# Altium project St_Olavs_Alarm.PrjPcb
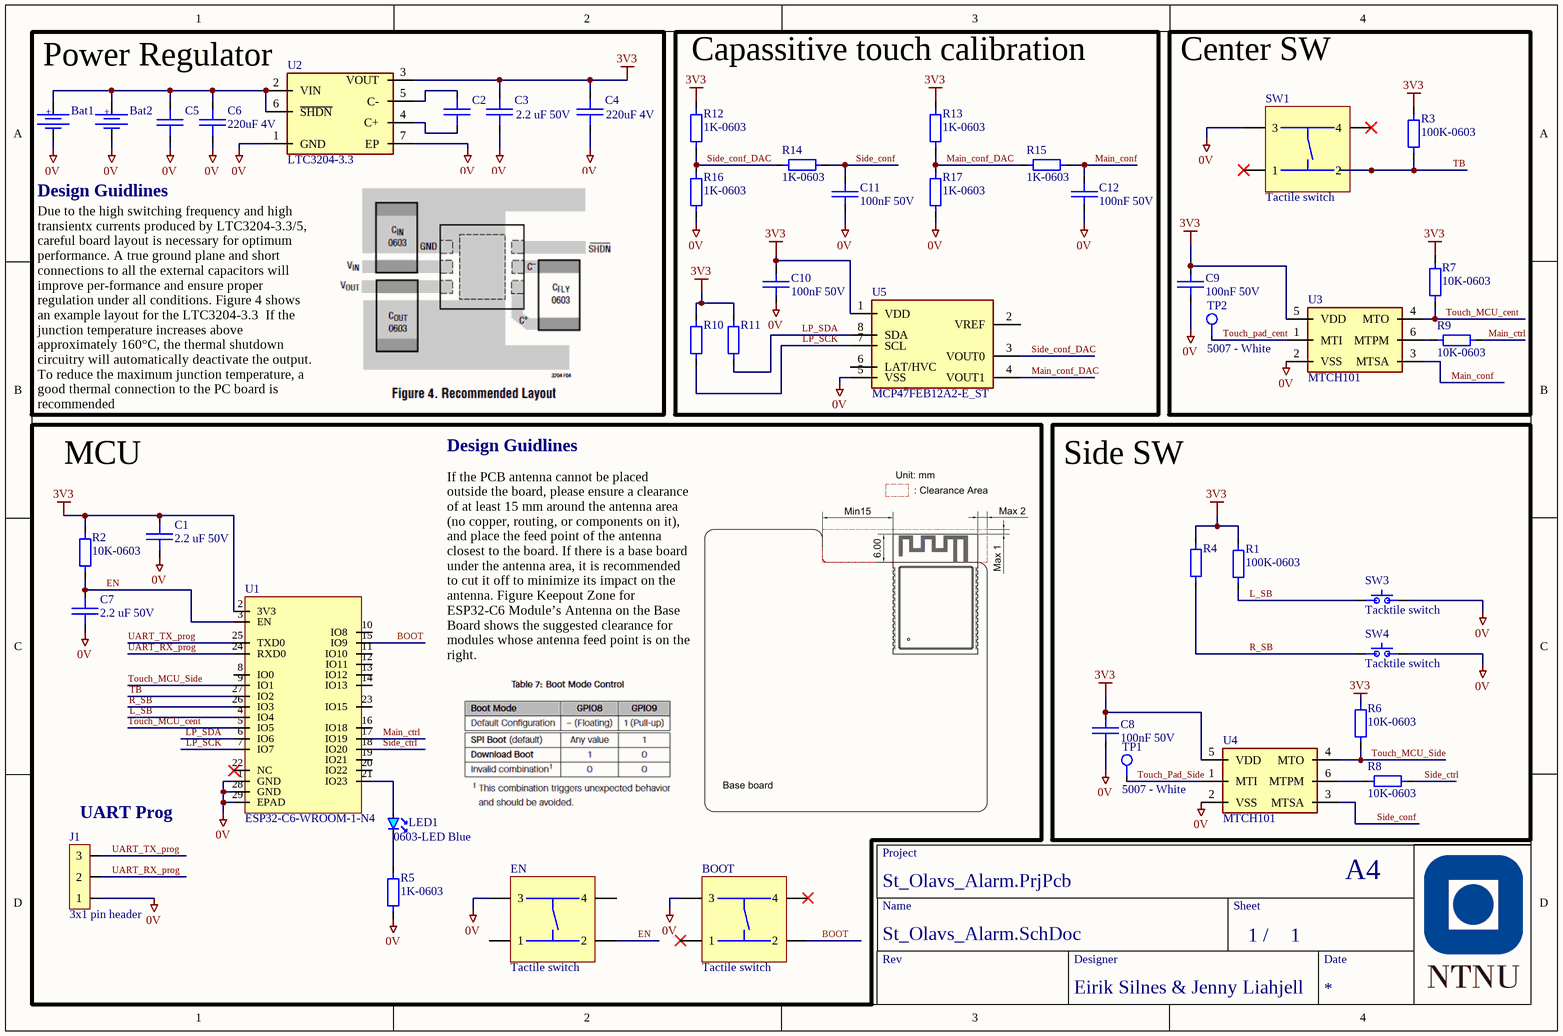
[diagram p0: St_Olavs_Alarm.SchDoc]
ProjectEngineer: Eirik Silnes & Jenny Liahjell
1 sheet, 45 parts. Net scope: strictly hierarchical (ports join the sheet entries above them; power ports are local).
Board file: St_Olavs_Alarm.PcbDoc

## Sheet St_Olavs_Alarm.SchDoc
size 292 x 193 mm; SheetNumber: 1; SheetTotal: 1

### Parts
Bat1  Bat Holder L-KLS5-CR2032-23-B1  [L-KLS5-CR2032-23-B1]  (value not drawn)
Bat2  Bat Holder L-KLS5-CR2032-23-B1  [L-KLS5-CR2032-23-B1]  (value not drawn)
BOOT  Tactile switch  [TE connectivity part no. 2-1437565-8]
C1  2.2 uF 50V  [0603 Capacitor]
C2  2.2 uF 50V  [0603 Capacitor]  (value not drawn)
C3  2.2 uF 50V  [0603 Capacitor]
C4  220uF 4V  [1206 CAPC3216X190N]
C5  220uF 4V  [1206 CAPC3216X190N]  (value not drawn)
C6  220uF 4V  [1206 CAPC3216X190N]
C7  2.2 uF 50V  [0603 Capacitor]
C8  100nF 50V  [0603 Capacitor]
C9  100nF 50V  [0603 Capacitor]
C10  100nF 50V  [0603 Capacitor]
C11  100nF 50V  [0603 Capacitor]
C12  100nF 50V  [0603 Capacitor]
EN  Tactile switch  [TE connectivity part no. 2-1437565-8]
J1  3x1 pin header  [Pin Header 1x3 TH Pitch 2.54mm]
LED1  0603-LED Blue  [0603-Diode LED, Blue]
R1  100K-0603  [0603 RESISTOR]
R2  10K-0603  [0603 RESISTOR]
R3  100K-0603  [0603 RESISTOR]
R4  100K-0603  [0603 RESISTOR]  (value not drawn)
R5  1K-0603  [0603 RESISTOR]
R6  10K-0603  [0603 RESISTOR]
R7  10K-0603  [0603 RESISTOR]
R8  10K-0603  [0603 RESISTOR]
R9  10K-0603  [0603 RESISTOR]
R10  10K-0603  [0603 RESISTOR]  (value not drawn)
R11  10K-0603  [0603 RESISTOR]  (value not drawn)
R12  1K-0603  [0603 RESISTOR]
R13  1K-0603  [0603 RESISTOR]
R14  1K-0603  [0603 RESISTOR]
R15  1K-0603  [0603 RESISTOR]
R16  1K-0603  [0603 RESISTOR]
R17  1K-0603  [0603 RESISTOR]
SW1  Tactile switch  [430182080816]
SW3  Tacktile switch  [KSS241GLFS]
SW4  Tacktile switch  [KSS241GLFS]
TP1  5007 - White  [5006-Footprint-1]
TP2  5007 - White  [5006-Footprint-1]
U1  ESP32-C6-WROOM-1-N4  [ESP32-C6-WROOM-1-N4-Footprint-1]
U2  LTC3204-3.3  [LTC3204]
U3  MTCH101  [SOT95P270X145-6N]
U4  MTCH101  [SOT95P270X145-6N]
U5  MCP47FEB12A2-E_ST  [SOP65P640X120-8N]

### Blocks framed on the sheet
Power Regulator: Bat1 Bat2 C2-C6 U2
Capassitive touch calibration: C10-C12 R10-R17 U5
Center SW: C9 R3 R7 R9 SW1 TP2 U3
MCU: BOOT C1 C7 EN J1 LED1 R2 R5 U1
Side SW: C8 R1 R4 R6 R8 SW3 SW4 TP1 U4

### Nets
0V: Bat1.2 Bat2.2 BOOT.3 C1.1 C3.1 C4.2 C5.2 C6.2 C7.1 C8.2 C9.2 C10.2 C11.2 C12.2 EN.3 J1.1 R5.1 R16.1 R17.2 SW1.3 SW3.2 SW4.2 U1.1(GND) U1.28(GND) U1.29(EPAD) U2.1(GND) U2.7(EP) U3.2(VSS) U4.2(VSS) U5.5(VSS)
3V3: C1.2 C3.2 C4.1 C8.1 C9.1 C10.1 R1.2 R2.2 R3.2 R4.2 R6.2 R7.2 R10.2 R11.2 R12.2 R13.1 U1.2(3V3) U2.3(VOUT) U3.5(VDD) U4.5(VDD) U5.1(VDD)
BOOT: BOOT.2 U1.15(IO9)
EN: C7.2 EN.2 R2.1 U1.3(EN)
L_SB: R1.1 SW3.1 U1.4(IO4)
LP_SCK: R10.1 U1.7(IO7) U5.7(SCL)
LP_SDA: R11.1 U1.6(IO6) U5.8(SDA)
Main_conf: C12.1 R15.1 U3.3(MTSA)
Main_conf_DAC: R13.2 R15.2 R17.1 U5.4(VOUT1)
Main_ctrl: R9.1 U1.17(IO19)
R_SB: R4.1 SW4.1 U1.26(IO3)
Side_conf: C11.1 R14.2 U4.3(MTSA)
Side_conf_DAC: R12.1 R14.1 R16.2 U5.3(VOUT0)
Side_ctrl: R8.2 U1.18(IO20)
TB: R3.1 SW1.2 U1.27(IO2)
Touch_MCU_cent: R7.1 U1.5(IO5) U3.4(MTO)
Touch_MCU_Side: R6.1 U1.9(IO1) U4.4(MTO)
Touch_pad_cent: TP2.1 U3.1(MTI)
Touch_Pad_Side: TP1.1 U4.1(MTI)
UART_RX_prog: J1.2 U1.24(RXD0)
UART_TX_prog: J1.3 U1.25(TXD0)
NetBat1_1: Bat1.1 Bat2.1 C5.1 C6.1 U2.2(VIN) U2.6(~{SHDN})
NetC2_1: C2.1 U2.4(C+)
NetC2_2: C2.2 U2.5(C-)
NetLED1_1: LED1.1(A) U1.21(IO23)
NetLED1_2: LED1.2(K) R5.2
NetR8_1: R8.1 U4.6(MTPM)
NetR9_2: R9.2 U3.6(MTPM)

Not connected (* = marked no-connect by the designer): BOOT 1* 4*; EN 1 4; SW1 1* 4*; U1 8(IO0) 10(IO8) 11(IO10) 12(IO11) 13(IO12) 14(IO13) 16(IO18) 19(IO21) 20(IO22) 22(NC)* 23(IO15); U5 2(VREF) 6(LAT/HVC)

### Notes on the sheet
- Design Guidlines
- Due to the high switching frequency and high transientx currents produced by LTC3204-3.3/5, careful board layout is necessary for optimum performance. A true ground plane and short connections to all the external capacitors will improve per-formance and ensure proper regulation under all conditions. Figure 4 shows an example layout for the LTC3204-3.3  If the junction temperature increases above approximately 160°C, the thermal shutdown circuitry will automatically deactivate the output. To reduce the maximum junction temperature, a good thermal connection to the PC board is recommended
- If the PCB antenna cannot be placed outside the board, please ensure a clearance of at least 15 mm around the antenna area (no copper, routing, or components on it), and place the feed point of the antenna closest to the board. If there is a base board under the antenna area, it is recommended to cut it off to minimize its impact on the antenna. Figure Keepout Zone for ESP32-C6 Module’s Antenna on the Base Board shows the suggested clearance for modules whose antenna feed point is on the right.
- (near J1) UART Prog
- Project
- Name
- Sheet
- A4
- Rev
- Designer
- /
- Date
- (in symbol CMP-023-000003.0.1) +

### Library data of the parts
Bat1 Bat2 = CMP-023-000003.0.1: Bat Holder CR2032 SMD; Manufacturer: KLS Electronic; Artikkelnr Noca: N.A.; Pad Count: 2; ComponentLink2URL: N.A.; Component Class: Connectors; ComponentLink1Description: Datasheet; LatestRevisionDate: 2019-08-29; Source: pca10056.SCHLIB; Author: rsk; Part Number: Bat Holder L-KLS5-CR2032-23-B1; Component Type: Standard; Value: Bat Holder CR2032; Footprint Doc: CR2032_HOLDER; Published: 2019-08-28; PartId: 100500651; Design Item ID: Bat Holder L-KLS5-CR2032-23-B1; ComponentLink2Description: Supplier link; Note: Bat Holder CR2032; Part number IPS: N.A.; ComponentLink1URL: http://www.klsele.com/admin/product_upload/20151124103736KLS5-CR2032-23-B.pdf; HelpURL: http://www.klsele.com/products/connectors/Coin-Cell-Holders-Series/4685.html; Part number Norautron: N.A.; Pin Count: 2; Manufacturer Part Number: L-KLS5-CR2032-23-B1
BOOT EN = Tactile switch SMD: Tactile switch SMD Mount
C1-C3 C7 = CAP 2.2uF: 2.2uF 10V 0603
C4-C6 = CAP 220uF: 220uF 4V 1206
C8-C12 = CAP 100nF: 100nF 50V 0603
J1 = CMP-001-A02-7: 2.54mm pitch
R1 R3 R4 = CMP-009-00186-5_1: Res 100K Ohm Thick Film 0603 1% 1/10W ±100ppm/°C Molded SMD SMD Paper T/R; Max Power Dissipation: 100mW; Features: Automotive AEC-Q200; Height: 0.022inch; Power Rating: 100mW; Military Standard: Not; Case Code (Imperial): 0603; Ratings: AEC-Q200; Depth: 0.8mm; Radiation Hardening: No; Width: 0.031inch; Case Code (Metric): 1608; Series: RMCF; Lead Free: Lead Free; Length: 1.55mm; Resistor Type: Thick Film; Temperature Coefficient: 100ppm/°C; Contact Plating: Tin,Matte; Construction: Rectangular; Number of Terminations: 2
R2 R6-R11 = CMP-009-00186-5: Res 10K Ohm Thick Film 0603 1% 1/10W ±100ppm/°C Molded SMD SMD Paper T/R; Max Power Dissipation: 100mW; Features: Automotive AEC-Q200; Height: 0.022inch; Power Rating: 100mW; Military Standard: Not; Case Code (Imperial): 0603; Ratings: AEC-Q200; Depth: 0.8mm; Radiation Hardening: No; Width: 0.031inch; Case Code (Metric): 1608; Series: RMCF; Lead Free: Lead Free; Length: 1.55mm; Resistor Type: Thick Film; Temperature Coefficient: 100ppm/°C; Contact Plating: Tin,Matte; Construction: Rectangular; Number of Terminations: 2
R5 R12-R17 = CMP-009-00186-5_1_1: Res 1K Ohm Thick Film 0603 1% 1/10W ±100ppm/°C Molded SMD SMD Paper T/R; Max Power Dissipation: 100mW; Features: Automotive AEC-Q200; Height: 0.022inch; Power Rating: 100mW; Military Standard: Not; Case Code (Imperial): 0603; Ratings: AEC-Q200; Depth: 0.8mm; Radiation Hardening: No; Width: 0.031inch; Case Code (Metric): 1608; Series: RMCF; Lead Free: Lead Free; Length: 1.55mm; Resistor Type: Thick Film; Temperature Coefficient: 100ppm/°C; Contact Plating: Tin,Matte; Construction: Rectangular; Number of Terminations: 2
SW1 = Tactile switch Big: Tactile switch SMD Longer Neck
SW3 SW4 = KSS241GLFS
TP1 TP2 = CMP-00049-A.2: KEYSTONE - 5007 - TEST POINT, THT, WHITE; Inside Diameter: 1.78mm; Outside Diameter: 3.18mm; Number of Ports: 1; Plating: Silver; Hole Diameter: 1.6mm; Body Material: PBT; Length: 8.89mm; Packaging: Bulk; Housing Color: White; Height: 0.35inch; Package Quantity: 100; REACH SVHC: No SVHC; Mount: PCB,Through Hole; Orientation: Straight; Lead Free: Lead Free; Flammability Rating: UL94 V-0; Material: Nylon,Bronze,Silver; Color: Black; Contact Plating: Tin,Silver; Contact Material: Bronze
U1 = CMP-020-00028-2: Multiprotocol Modules ESP32-C6 module, Wi-Fi 6 in 2.4 GHz band, Bluetooth 5, Zigbee 3.0 and Thread. ESP32-WROOM Compatible
U3 U4 = MTCH101-I_OT: Capasitive touch sensor; Manufacturer_Name: Microchip; Manufacturer_Part_Number: MTCH101-I/OT; Datasheet Link: https://componentsearchengine.com/Datasheets/2/MTCH101-I_OT.pdf; Height: 1.45mm; Mouser Part Number: 579-MTCH101-I/OT; Mouser Price/Stock: https://www.mouser.co.uk/ProductDetail/Microchip-Technology/MTCH101-I-OT?qs=VteoEApvSIB767sF5JiK8g%3D%3D; Arrow Part Number: MTCH101-I/OT; Arrow Price/Stock: https://www.arrow.com/en/products/mtch101-iot/microchip-technology?region=nac
U5 = MCP47FEB12A2-E_ST: Integrated Circuit; Manufacturer_Name: Microchip; Manufacturer_Part_Number: MCP47FEB12A2-E/ST; Datasheet Link: https://mouser.componentsearchengine.com/Datasheets/1/MCP47FEB12A2-E_ST.pdf; Height: 1.2mm; Mouser Part Number: 579-MCP47FEB12A2EST; Mouser Price/Stock: https://www.mouser.co.uk/ProductDetail/Microchip-Technology/MCP47FEB12A2-E-ST?qs=rQCxX1QmdjLtqLT1GQsN%252BQ%3D%3D; Arrow Part Number: MCP47FEB12A2-E/ST; Arrow Price/Stock: https://www.arrow.com/en/products/mcp47feb12a2-est/microchip-technology